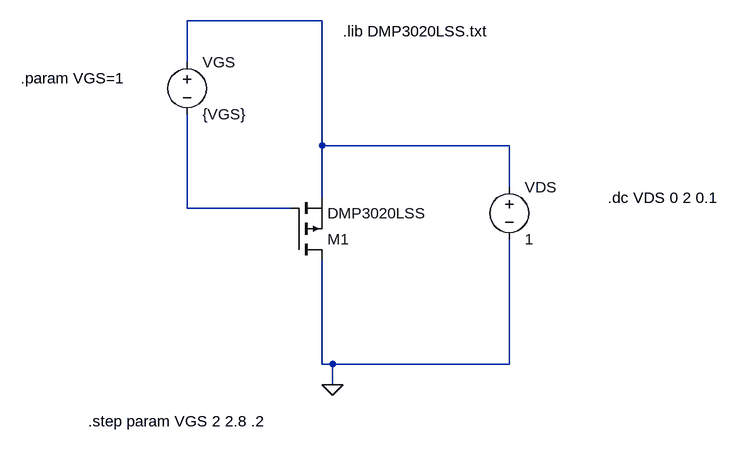
[diagram p0: schematic pmos_dmp3020lss.asc]
pmos_dmp3020lss.asc, the LTspice schematic file:
Version 4
SHEET 1 880 680
WIRE 160 -160 -48 -160
WIRE -48 -96 -48 -160
WIRE 160 32 160 -160
WIRE 448 32 160 32
WIRE 448 96 448 32
WIRE 160 112 160 32
WIRE -48 128 -48 -16
WIRE 112 128 -48 128
WIRE 160 368 160 208
WIRE 176 368 160 368
WIRE 448 368 448 176
WIRE 448 368 176 368
WIRE 176 400 176 368
FLAG 176 400 0
SYMBOL pmos 112 208 M180
SYMATTR InstName M1
SYMATTR Value DMP3020LSS
SYMATTR Prefix X
SYMBOL voltage -48 -112 R0
SYMATTR InstName VGS
SYMATTR Value {VGS}
SYMBOL voltage 448 80 R0
SYMATTR InstName VDS
SYMATTR Value 1
TEXT 192 -144 Left 2 !.lib DMP3020LSS.txt
TEXT -304 -72 Left 2 !.param VGS=1
TEXT -200 456 Left 2 !.step param VGS 2 2.8 .2
TEXT 600 112 Left 2 !.dc VDS 0 2 0.1

The netlist it stands for:
* pmos_dmp3020lss.asc
XM1 0 N002 N001 DMP3020LSS  ; pins D G S
VGS N001 N002 {VGS}
VDS N001 0 1
.lib DMP3020LSS.txt
.param VGS=1
.step param VGS 2 2.8 .2
.dc VDS 0 2 0.1
.backanno
.end